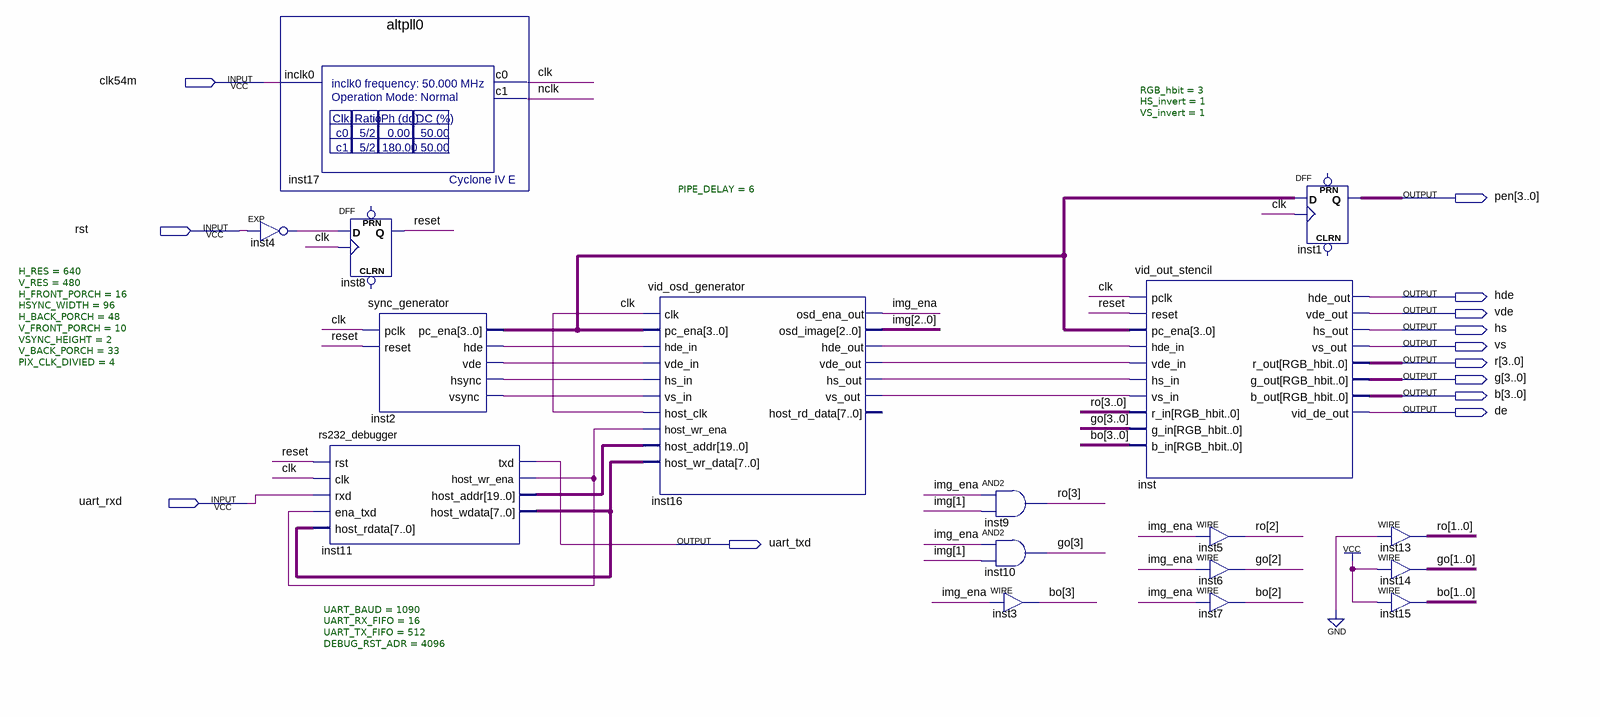
[diagram p0: schematic sheet]
// Quartus schematic GPU.bdf as structural Verilog: 17 symbols, 13 pins
module GPU (
  input  clk54m,
  input  rst,
  input  uart_rxd,
  output [3:0] pen,
  output hde,
  output vde,
  output hs,
  output vs,
  output [3:0] r,
  output [3:0] g,
  output [3:0] b,
  output de,
  output uart_txd
);

  wire clk, img_ena, inst2_hde, inst2_hsync, inst2_vde, inst2_vsync, inst4_out, inst11_host_wr_ena,
       inst16_hde_out, inst16_hs_out, inst16_vde_out, inst16_vs_out, nclk, reset;
  wire [2:0] img;
  wire [3:0] bo, go, inst2_pc_ena, ro;
  wire [7:0] inst11_host_wdata;
  wire [19:0] inst11_host_addr;

  altpll0 inst17 (.inclk0(clk54m), .c0(clk), .c1(nclk));
  EXP inst4 (.IN(rst), .OUT(inst4_out));
  DFF inst8 (.CLK(clk), .D(inst4_out), .Q(reset));  // open: CLRN, PRN
  rs232_debugger #(.UART_BAUD(1090), .UART_RX_FIFO(16), .UART_TX_FIFO(512), .DEBUG_RST_ADR(4096)) inst11 (
    .rst(reset), .clk(clk), .rxd(uart_rxd), .ena_txd(inst11_host_wr_ena), .host_rdata(inst11_host_wdata),
    .txd(uart_txd), .host_wr_ena(inst11_host_wr_ena), .host_addr(inst11_host_addr),
    .host_wdata(inst11_host_wdata));
  sync_generator #(.H_RES(640), .V_RES(480), .H_FRONT_PORCH(16), .HSYNC_WIDTH(96), .H_BACK_PORCH(48), .V_FRONT_PORCH(10), .VSYNC_HEIGHT(2), .V_BACK_PORCH(33), .PIX_CLK_DIVIED(4)) inst2 (
    .pclk(clk), .reset(reset), .pc_ena(inst2_pc_ena), .hde(inst2_hde), .vde(inst2_vde), .hsync(inst2_hsync),
    .vsync(inst2_vsync));
  vid_osd_generator #(.PIPE_DELAY(6)) inst16 (
    .clk(clk), .pc_ena(inst2_pc_ena), .hde_in(inst2_hde), .vde_in(inst2_vde), .hs_in(inst2_hsync),
    .vs_in(inst2_vsync), .host_clk(clk), .host_wr_ena(inst11_host_wr_ena), .host_addr(inst11_host_addr),
    .host_wr_data(inst11_host_wdata), .osd_ena_out(img_ena), .osd_image(img), .hde_out(inst16_hde_out),
    .vde_out(inst16_vde_out), .hs_out(inst16_hs_out), .vs_out(inst16_vs_out));  // open: host_rd_data
  and inst9 (ro[3], img_ena, img[1]);
  and inst10 (go[3], img_ena, img[1]);
  assign bo[3] = img_ena;  // WIRE inst3
  vid_out_stencil #(.RGB_hbit(3), .HS_invert(1), .VS_invert(1)) inst (
    .pclk(clk), .reset(reset), .pc_ena(inst2_pc_ena), .hde_in(inst16_hde_out), .vde_in(inst16_vde_out),
    .hs_in(inst16_hs_out), .vs_in(inst16_vs_out), .r_in(ro), .g_in(go), .b_in(bo), .hde_out(hde),
    .vde_out(vde), .hs_out(hs), .vs_out(vs), .r_out(r), .g_out(g), .b_out(b), .vid_de_out(de));
  assign ro[2] = img_ena;  // WIRE inst5
  assign go[2] = img_ena;  // WIRE inst6
  assign bo[2] = img_ena;  // WIRE inst7
  DFF inst1[3:0] (.CLK(clk), .D(inst2_pc_ena), .Q(pen));  // open: CLRN, PRN
  assign ro[1:0] = 2'b00;  // WIRE inst13
  assign go[1:0] = 2'b11;  // WIRE inst14
  assign bo[1:0] = 2'b11;  // WIRE inst15
endmodule
